# EasyEDA schematic NogasmLink.json

## Sheets
1 NogasmLink_current: TITLE: NogasmLink (custom soldered); REV: 1.0; Date: 2025-05-20; Sheet: 1/1; Drawn By: 1; Company: Your Company
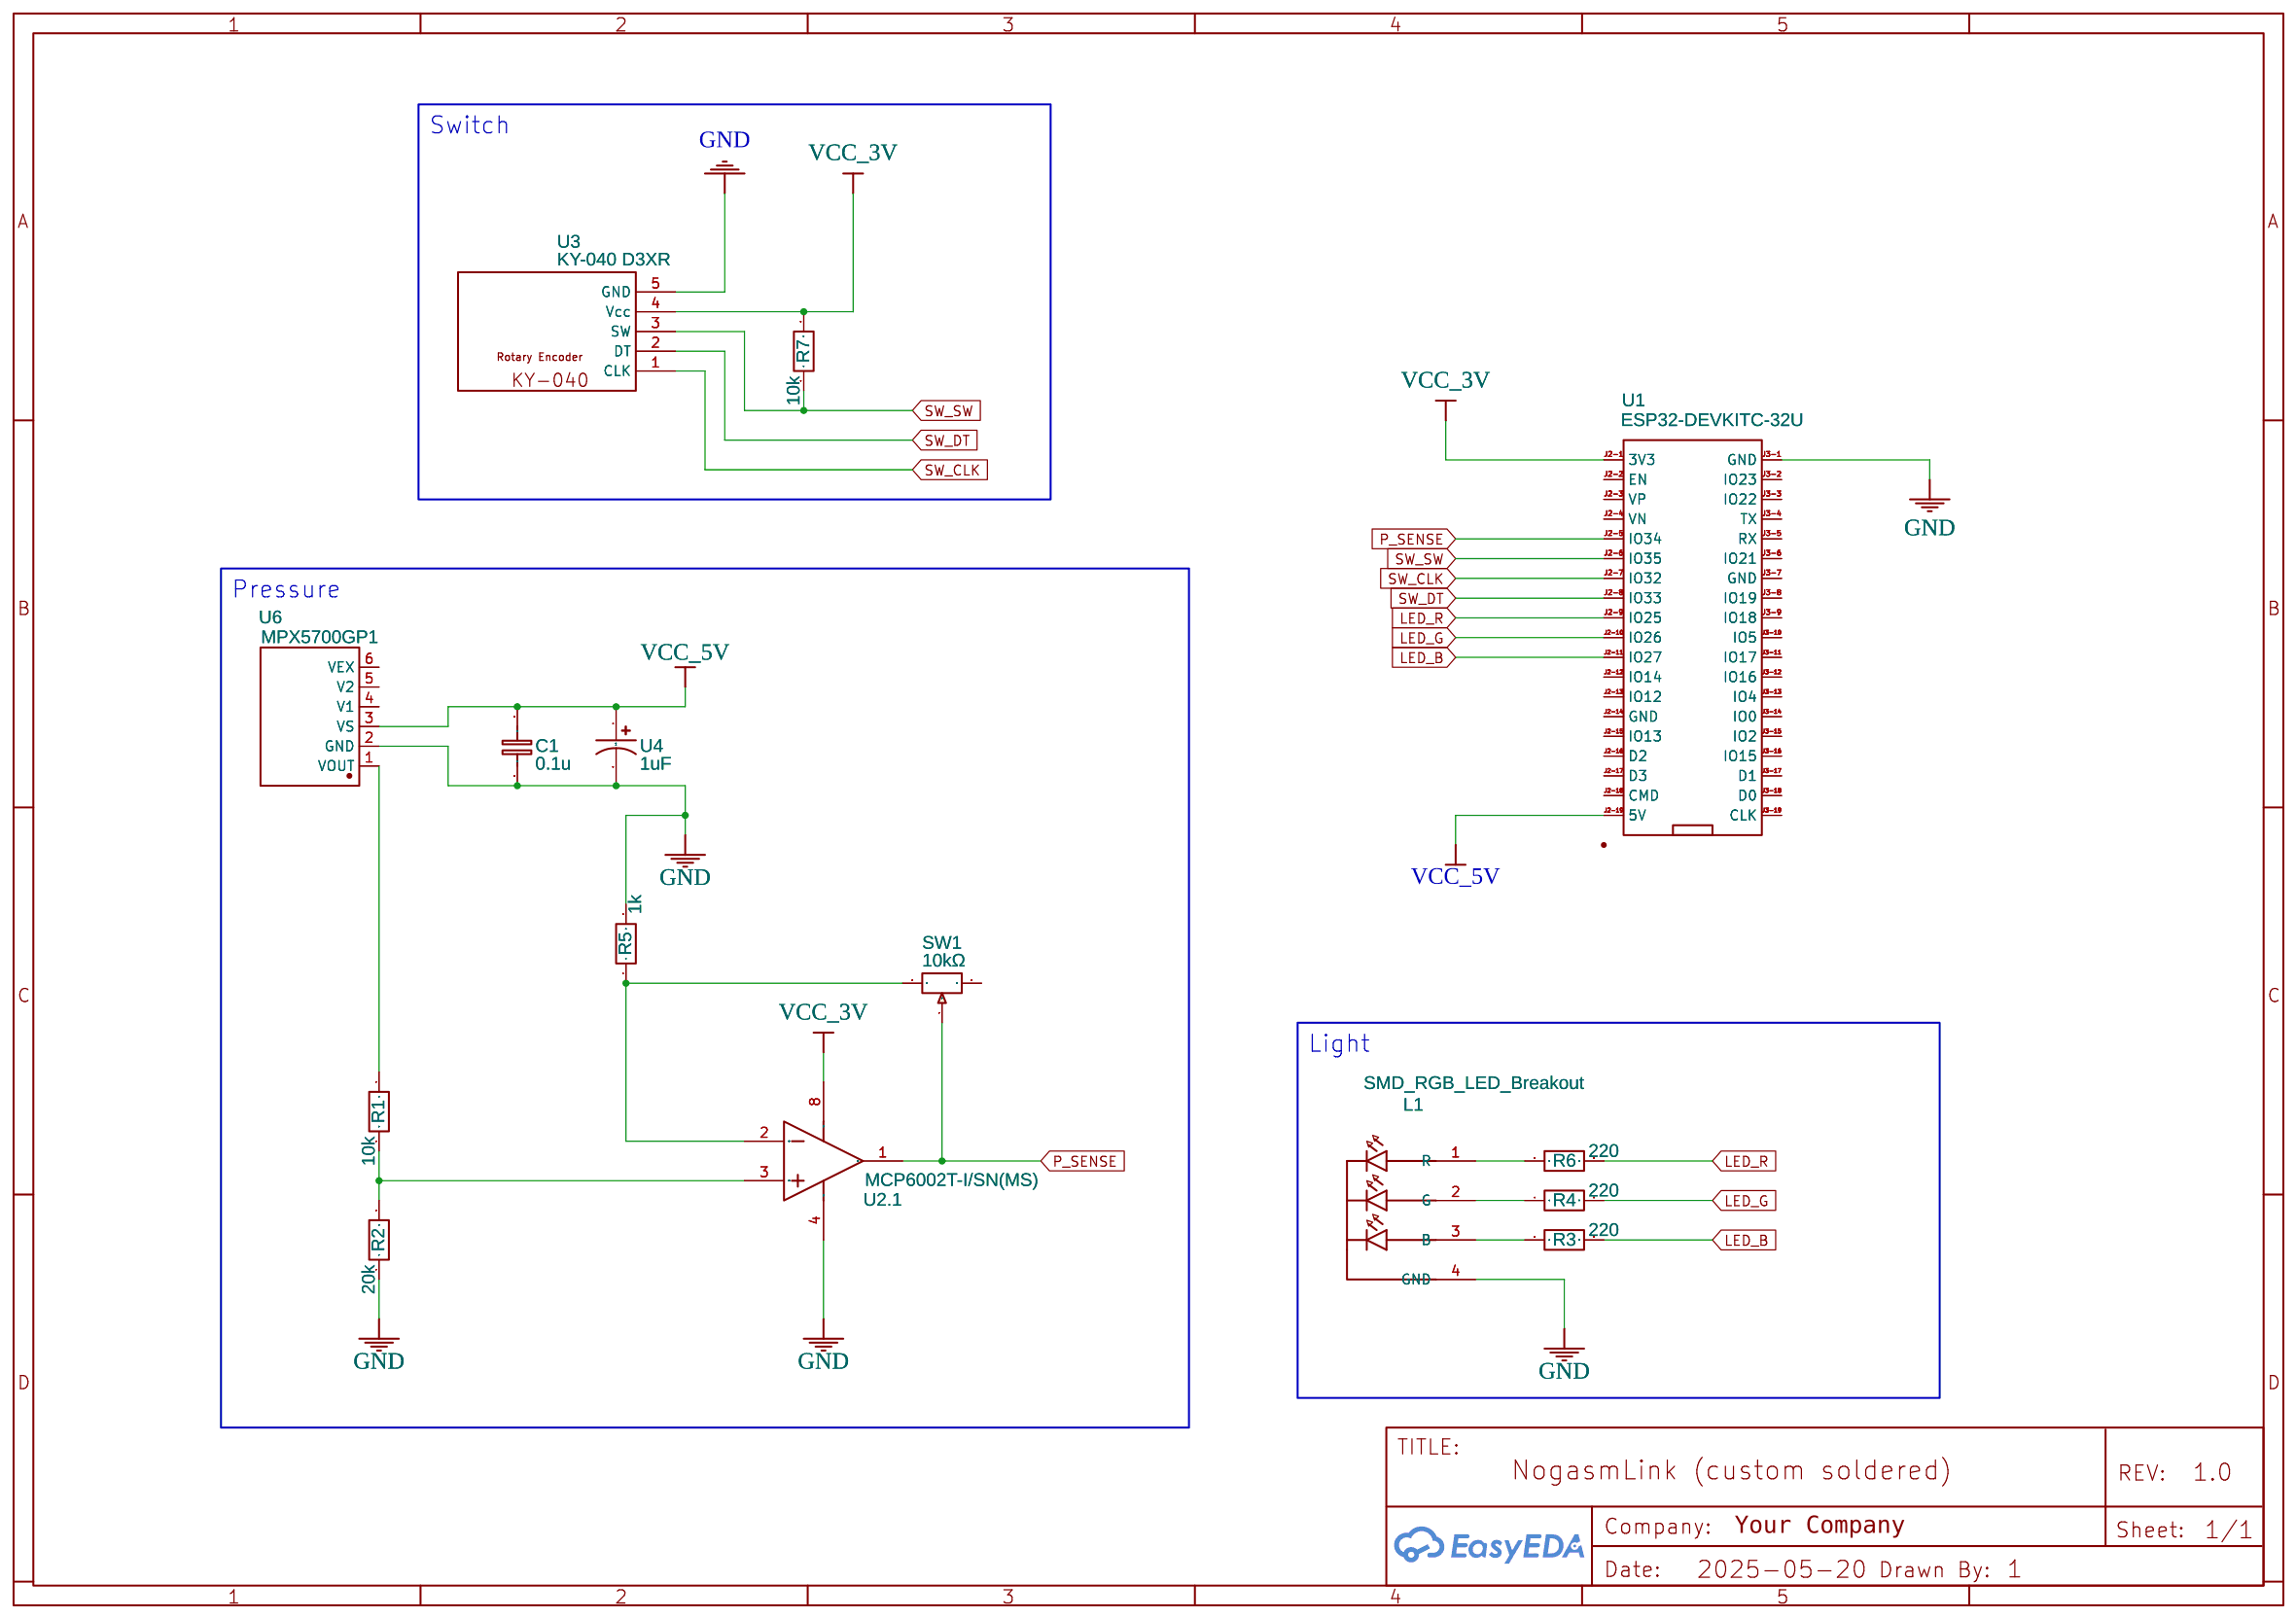
[diagram p0: NogasmLink_current]
2 NogasmLink_assembled: TITLE: Sheet_1
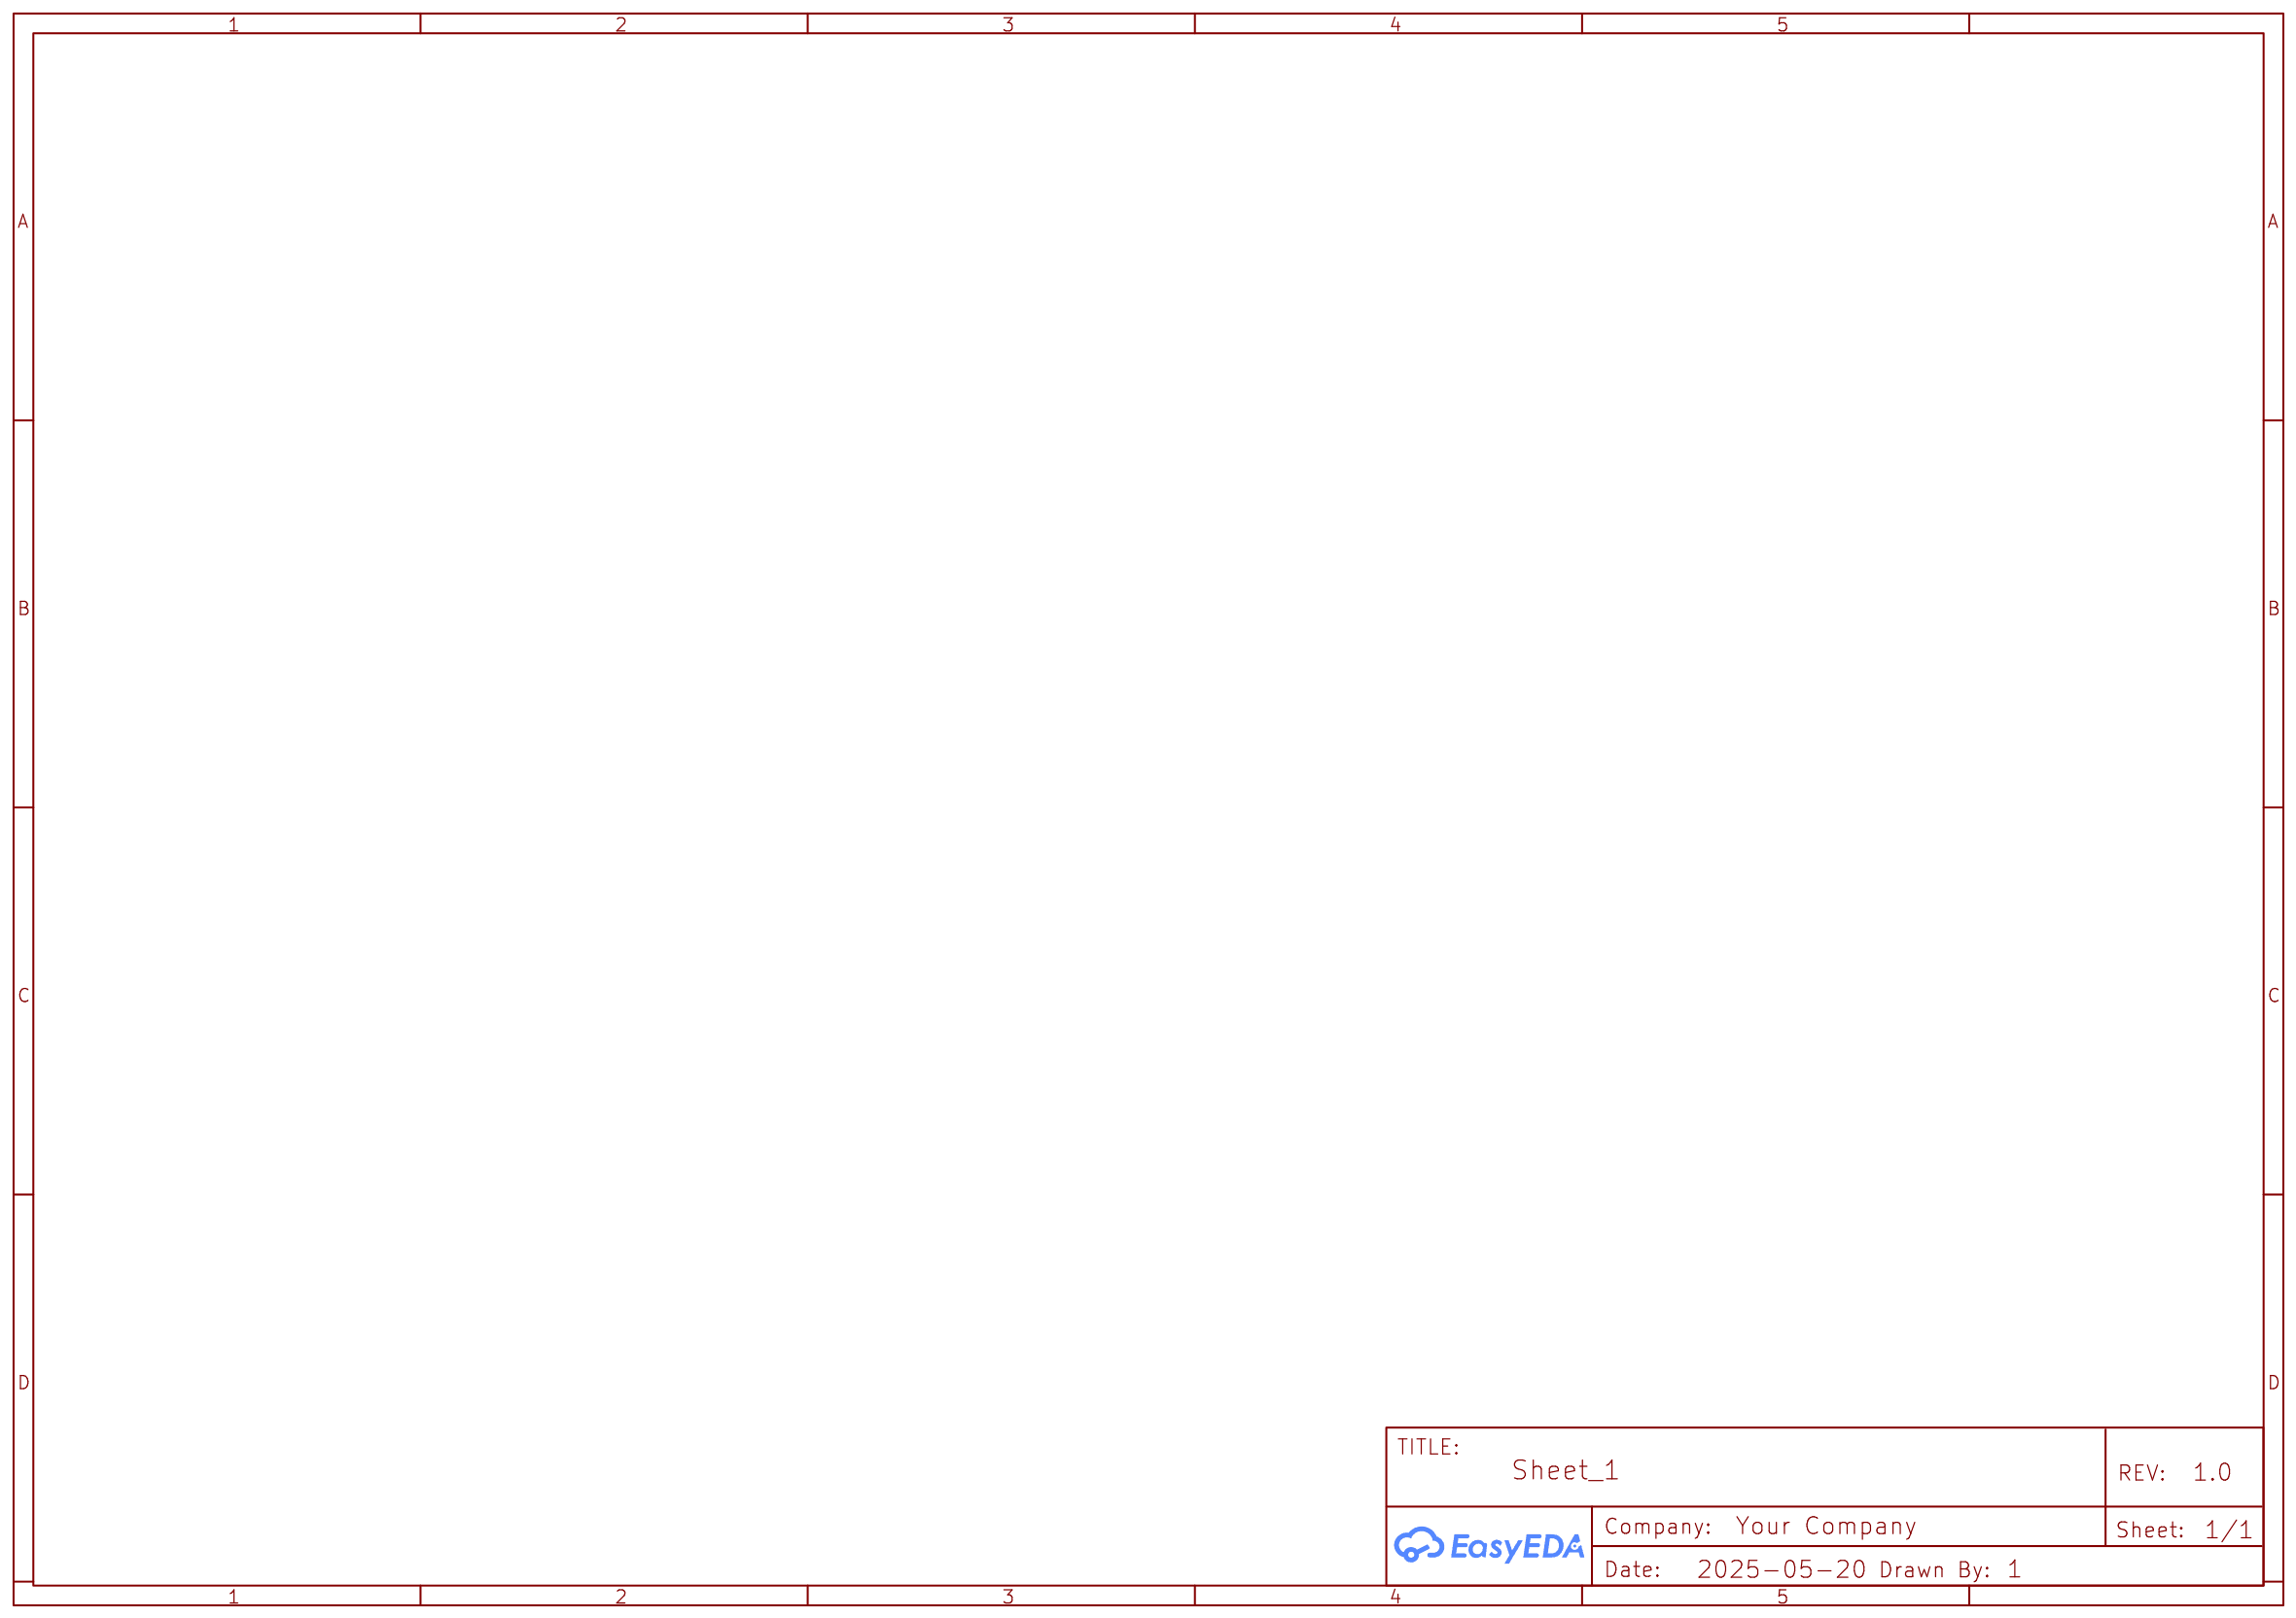
[diagram p1: NogasmLink_assembled]

## Parts
C1  0.1u  [C0603]
L1  SMD_RGB_LED_Breakout  [RGB-LED-0606]
R1  10k  [R0603]
R2  20k  [R0603]
R3  220  [R0603]
R4  220  [R0603]
R5  1k  [R0603]
R6  220  [R0603]
R7  10k  [R0603]
SW1  10kΩ  [RES-ADJ-TH_3P_L9.6-W4.8-P2.50-L]
U1  ESP32-DEVKITC-32U  [ESP32_DEVKITC_V4_WROOM32U]
U2  MCP6002T-I/SN(MS)  [SOIC-8_L4.9-W3.9-P1.27-LS6.0-BL]  (section 1)
U3  KY-040 D3XR  [KY-040]
U4  1uF  [CAP-TH_BD5.0-P2.00-D0.5-FD-1]
U6  MPX5700GP1  [SENSOR-TH_MPX5700AP]

## Library data of the parts
C1 = C_0603_EU: Contributor: LCEDA_Lib
L1 = SMD_RGB_LED_Breakout: Contributor: derjungeinhd
R1-R7 = R_0603_EU: Contributor: LCEDA_Lib
SW1 = CT-94EW103: Contributor: LCSC; Supplier: LCSC; Supplier Part: C2921725; Manufacturer: NIDEC(尼得科); JLCPCB Part Class: Extended Part
U1 = ESP32-DEVKITC-32U SAMDIL: Supplier Part: C571181; Manufacturer: ESPRESSIF(乐鑫); Manufacturer Part: ESP32-DevKitC-32D; JLCPCB Part Class: Extended Part; Contributor: nhatquang16042001
U2 = MCP6002T-I/SN(MS): Supplier: LCSC; Supplier Part: C20538868; Manufacturer: MSKSEMI(美森科); JLCPCB Part Class: Extended Part; subpart_no: 1
U3 = KY-040 D3XR: Contributor: Юрий Владимирович (Duck Duck)
U4 = NP1061HMC115RB: Contributor: lcsc; Supplier: LCSC; Supplier Part: C3003236; Manufacturer: Xunda(讯达); JLCPCB Part Class: Extended Part
U6 = MPX5700GP1: Contributor: lcsc; Supplier: LCSC; Supplier Part: C3256337; Manufacturer: NXP(恩智浦); JLCPCB Part Class: Extended Part

## Nets
GND: C1.1 L1.4(GND) R2.1 R5.2 U1.J3-1(GND) U2.4(VSS) U3.5(GND) U4.2 U6.2(GND)
VCC_3V: R7.2 U1.J2-1(3V3) U2.8(VDD) U3.4(Vcc)
VCC_5V: C1.2 U1.J2-19(5V) U4.1 U6.3(VS)
LED_B: R3.2 U1.J2-11(IO27)
LED_G: R4.2 U1.J2-10(IO26)
LED_R: R6.2 U1.J2-9(IO25)
P_SENSE: SW1.2 U1.J2-5(IO34) U2.1(VOUTA)
SW_CLK: U1.J2-7(IO32) U3.1(CLK)
SW_DT: U1.J2-8(IO33) U3.2(DT)
SW_SW: R7.1 U1.J2-6(IO35) U3.3(SW)
Net-(L1-1): L1.1(R) R6.1
Net-(L1-2): L1.2(G) R4.1
Net-(L1-3): L1.3(B) R3.1
Net-(R1-1): R1.1 U6.1(VOUT)
Net-(R1-2): R1.2 R2.2 U2.3(VINA+)
Net-(R5-1): R5.1 SW1.3 U2.2(VINA-)

Not connected (* = marked no-connect by the designer): SW1 1; U1 J2-2(EN) J2-3(VP) J2-4(VN) J2-12(IO14) J2-13(IO12) J2-14(GND) J2-15(IO13) J2-16(D2) J2-17(D3) J2-18(CMD) J3-2(IO23) J3-3(IO22) J3-4(TX) J3-5(RX) J3-6(IO21) J3-7(GND) J3-8(IO19) J3-9(IO18) J3-10(IO5) J3-11(IO17) J3-12(IO16) J3-13(IO4) J3-14(IO0) J3-15(IO2) J3-16(IO15) J3-17(D1) J3-18(D0) J3-19(CLK); U6 4(V1) 5(V2) 6(VEX)

## Notes on the sheets
sheet 1
- Switch
- Pressure
- Light
